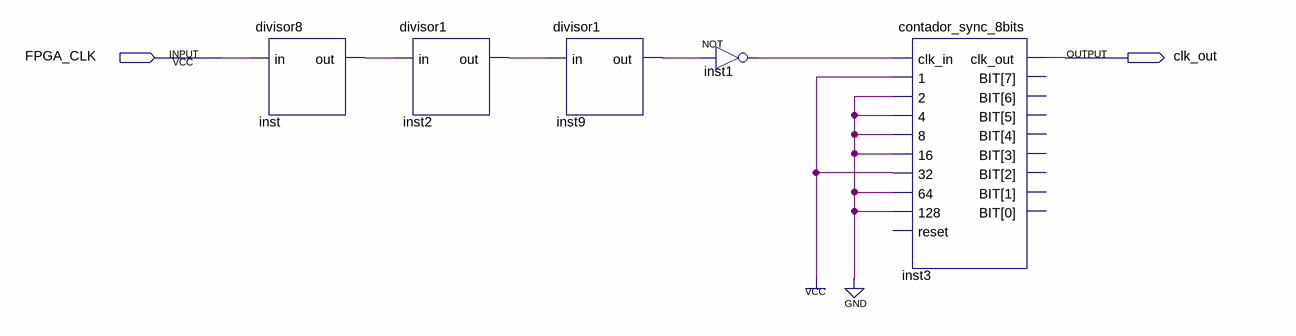
[diagram p0: schematic sheet]
// Quartus schematic freq_740hz.bdf as structural Verilog: 5 symbols, 2 pins
module freq_740hz (
  input  FPGA_CLK,
  output clk_out
);

  wire inst1_out, inst2_out, inst9_out, inst_out;

  divisor8 inst (.in(FPGA_CLK), .out(inst_out));
  divisor1 inst2 (.in(inst_out), .out(inst2_out));
  divisor1 inst9 (.in(inst2_out), .out(inst9_out));
  not inst1 (inst1_out, inst9_out);
  contador_sync_8bits inst3 (
    .clk_in(inst1_out), .\1 (1'b1), .\2 (1'b0), .\4 (1'b0), .\8 (1'b0), .\16 (1'b0), .\32 (1'b1),
    .\64 (1'b0), .\128 (1'b0), .clk_out(clk_out));  // open: reset, BIT
endmodule
